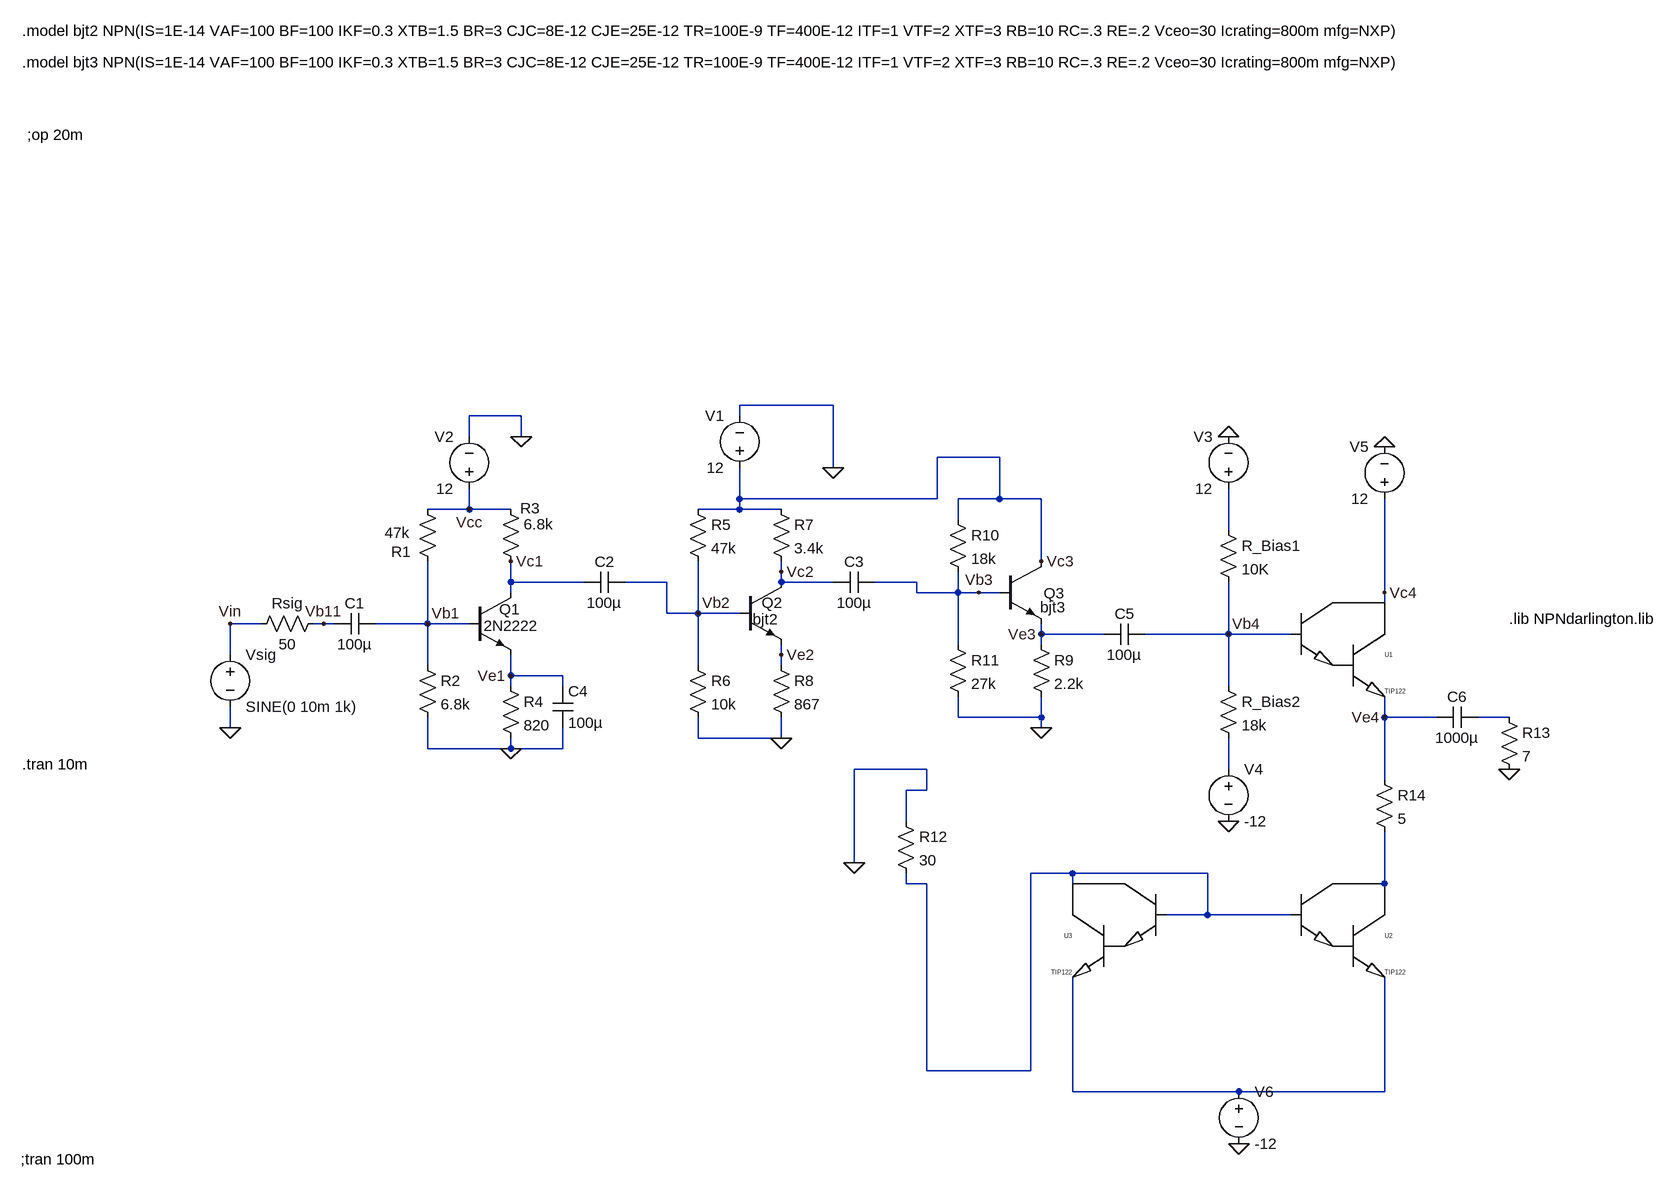
[diagram p0: schematic AMP.asc]
AMP.asc, the LTspice schematic file:
Version 4
SHEET 1 2644 1032
WIRE 736 -144 592 -144
WIRE 256 -128 176 -128
WIRE 592 -128 592 -144
WIRE 176 -96 176 -128
WIRE 256 -96 256 -128
WIRE 992 -64 896 -64
WIRE 736 -48 736 -144
WIRE 592 0 592 -48
WIRE 896 0 896 -64
WIRE 896 0 592 0
WIRE 992 0 992 -64
WIRE 992 0 928 0
WIRE 1056 0 992 0
WIRE 176 16 176 -16
WIRE 176 16 112 16
WIRE 240 16 176 16
WIRE 592 16 592 0
WIRE 592 16 528 16
WIRE 656 16 592 16
WIRE 928 32 928 0
WIRE 1344 48 1344 -16
WIRE 1056 96 1056 0
WIRE 656 112 656 96
WIRE 240 128 240 96
WIRE 352 128 240 128
WIRE 480 128 416 128
WIRE 656 128 656 112
WIRE 736 128 656 128
WIRE 864 128 800 128
WIRE 240 144 240 128
WIRE 864 144 864 128
WIRE 928 144 928 112
WIRE 928 144 864 144
WIRE 960 144 928 144
WIRE 992 144 960 144
WIRE 1584 144 1584 0
WIRE 1584 160 1584 144
WIRE 480 176 480 128
WIRE 528 176 528 96
WIRE 528 176 480 176
WIRE 592 176 528 176
WIRE -144 192 -192 192
WIRE -48 192 -64 192
WIRE -32 192 -48 192
WIRE 112 192 112 96
WIRE 112 192 32 192
WIRE 176 192 112 192
WIRE 1056 208 1056 192
WIRE 1152 208 1056 208
WIRE 1344 208 1344 128
WIRE 1344 208 1216 208
WIRE 1440 208 1344 208
WIRE 928 224 928 144
WIRE 1056 224 1056 208
WIRE -192 240 -192 192
WIRE 656 240 656 224
WIRE 112 256 112 192
WIRE 528 256 528 176
WIRE 656 256 656 240
WIRE 240 272 240 240
WIRE 320 272 240 272
WIRE 240 288 240 272
WIRE 320 288 320 272
WIRE 1344 288 1344 208
WIRE 928 336 928 304
WIRE 1056 336 1056 304
WIRE 1056 336 928 336
WIRE 1584 336 1584 304
WIRE 1664 336 1584 336
WIRE 1776 336 1728 336
WIRE -192 352 -192 320
WIRE 1056 352 1056 336
WIRE 528 368 528 336
WIRE 656 368 656 336
WIRE 656 368 528 368
WIRE 112 384 112 336
WIRE 240 384 240 368
WIRE 240 384 112 384
WIRE 320 384 320 352
WIRE 320 384 240 384
WIRE 880 416 768 416
WIRE 1344 416 1344 368
WIRE 1584 432 1584 336
WIRE 880 448 880 416
WIRE 880 448 848 448
WIRE 848 496 848 448
WIRE 768 560 768 416
WIRE 1104 576 1040 576
WIRE 1312 576 1104 576
WIRE 848 592 848 576
WIRE 880 592 848 592
WIRE 1104 592 1104 576
WIRE 1584 592 1584 512
WIRE 1584 624 1584 592
WIRE 1312 640 1312 576
WIRE 1312 640 1248 640
WIRE 1440 640 1312 640
WIRE 880 880 880 592
WIRE 1040 880 1040 576
WIRE 1040 880 880 880
WIRE 1104 912 1104 736
WIRE 1360 912 1104 912
WIRE 1584 912 1584 736
WIRE 1584 912 1360 912
FLAG 656 368 0
FLAG 256 -96 0
FLAG -192 352 0
FLAG 112 192 Vb1
FLAG 528 176 Vb2
FLAG 656 240 Ve2
FLAG 656 112 Vc2
FLAG 240 96 Vc1
FLAG -192 192 Vin
FLAG 176 16 Vcc
FLAG 240 272 Ve1
FLAG 736 -48 0
FLAG -48 192 Vb11
FLAG 240 384 0
FLAG 1056 352 0
FLAG 960 144 Vb3
FLAG 1056 208 Ve3
FLAG 1056 96 Vc3
FLAG 1344 -96 0
FLAG 1344 496 0
FLAG 1584 -80 0
FLAG 1776 416 0
FLAG 1344 208 Vb4
FLAG 1584 144 Vc4
FLAG 1584 336 Ve4
FLAG 1360 992 0
FLAG 768 560 0
SYMBOL npn 176 144 R0
WINDOW 0 46 26 Left 2
WINDOW 3 22 51 Left 2
SYMATTR InstName Q1
SYMATTR Value 2N2222
SYMBOL res 96 0 R0
WINDOW 0 -40 81 Left 2
WINDOW 3 -50 52 Left 2
SYMATTR InstName R1
SYMATTR Value 47k
SYMBOL res 96 240 R0
SYMATTR InstName R2
SYMATTR Value 6.8k
SYMBOL res 224 0 R0
WINDOW 0 30 14 Left 2
WINDOW 3 36 39 Left 2
SYMATTR InstName R3
SYMATTR Value 6.8k
SYMBOL res 224 272 R0
SYMATTR InstName R4
SYMATTR Value 820
SYMBOL res -48 176 R90
WINDOW 0 0 56 VBottom 2
WINDOW 3 32 56 VTop 2
SYMATTR InstName Rsig
SYMATTR Value 50
SYMBOL cap 32 176 R90
WINDOW 0 0 32 VBottom 2
WINDOW 3 32 32 VTop 2
SYMATTR InstName C1
SYMATTR Value 100µ
SYMBOL npn 592 128 R0
WINDOW 0 34 32 Left 2
WINDOW 3 20 57 Left 2
SYMATTR InstName Q2
SYMATTR Value bjt2
SYMBOL res 640 0 R0
SYMATTR InstName R7
SYMATTR Value 3.4k
SYMBOL res 512 0 R0
SYMATTR InstName R5
SYMATTR Value 47k
SYMBOL res 512 240 R0
SYMATTR InstName R6
SYMATTR Value 10k
SYMBOL res 640 240 R0
SYMATTR InstName R8
SYMATTR Value 867
SYMBOL cap 800 112 R90
WINDOW 0 0 32 VBottom 2
WINDOW 3 32 32 VTop 2
SYMATTR InstName C3
SYMATTR Value 100µ
SYMBOL voltage -192 224 R0
WINDOW 123 0 0 Left 0
WINDOW 39 0 0 Left 0
SYMATTR InstName Vsig
SYMATTR Value SINE(0 10m 1k)
SYMBOL voltage 176 0 R180
WINDOW 0 24 96 Left 2
WINDOW 3 24 16 Left 2
WINDOW 123 0 0 Left 0
WINDOW 39 0 0 Left 0
SYMATTR InstName V2
SYMATTR Value 12
SYMBOL voltage 592 -32 R180
WINDOW 0 24 96 Left 2
WINDOW 3 24 16 Left 2
SYMATTR InstName V1
SYMATTR Value 12
SYMBOL cap 416 112 R90
WINDOW 0 0 32 VBottom 2
WINDOW 3 32 32 VTop 2
SYMATTR InstName C2
SYMATTR Value 100µ
SYMBOL cap 304 288 R0
SYMATTR InstName C4
SYMATTR Value 100µ
SYMBOL npn 992 96 R0
WINDOW 0 68 49 Left 2
WINDOW 3 62 71 Left 2
SYMATTR InstName Q3
SYMATTR Value bjt3
SYMBOL res 1040 208 R0
SYMATTR InstName R9
SYMATTR Value 2.2k
SYMBOL res 912 16 R0
SYMATTR InstName R10
SYMATTR Value 18k
SYMBOL res 912 208 R0
SYMATTR InstName R11
SYMATTR Value 27k
SYMBOL cap 1216 192 R90
WINDOW 0 0 32 VBottom 2
WINDOW 3 32 32 VTop 2
SYMATTR InstName C5
SYMATTR Value 100µ
SYMBOL NpnDarlington 1456 160 R0
WINDOW 3 128 136 Left 0
SYMATTR InstName U1
SYMATTR SpiceModel ""
SYMBOL res 1328 32 R0
SYMATTR InstName R_Bias1
SYMATTR Value 10K
SYMBOL res 1328 272 R0
SYMATTR InstName R_Bias2
SYMATTR Value 18k
SYMBOL voltage 1344 0 R180
WINDOW 0 24 96 Left 2
WINDOW 3 24 16 Left 2
SYMATTR InstName V3
SYMATTR Value 12
SYMBOL voltage 1344 400 R0
SYMATTR InstName V4
SYMATTR Value -12
SYMBOL voltage 1584 16 R180
WINDOW 0 24 96 Left 2
WINDOW 3 24 16 Left 2
SYMATTR InstName V5
SYMATTR Value 12
SYMBOL cap 1728 320 R90
WINDOW 0 0 32 VBottom 2
WINDOW 3 32 32 VTop 2
SYMATTR InstName C6
SYMATTR Value 1000µ
SYMBOL res 1760 320 R0
SYMATTR InstName R13
SYMATTR Value 7
SYMBOL NpnDarlington 1456 592 R0
WINDOW 3 128 136 Left 0
SYMATTR InstName U2
SYMATTR SpiceModel ""
SYMBOL NpnDarlington 1232 592 M0
WINDOW 3 128 136 Left 0
SYMATTR InstName U3
SYMATTR SpiceModel ""
SYMBOL voltage 1360 896 R0
SYMATTR InstName V6
SYMATTR Value -12
SYMBOL res 832 480 R0
SYMATTR InstName R12
SYMATTR Value 30
SYMBOL res 1568 416 R0
SYMATTR InstName R14
SYMATTR Value 5
TEXT -504 -560 Left 2 !;op 20m
TEXT -512 -720 Left 2 !.model bjt2 NPN(IS=1E-14 VAF=100 BF=100 IKF=0.3 XTB=1.5 BR=3 CJC=8E-12 CJE=25E-12 TR=100E-9 TF=400E-12 ITF=1 VTF=2 XTF=3 RB=10 RC=.3 RE=.2 Vceo=30 Icrating=800m mfg=NXP)
TEXT -512 -672 Left 2 !.model bjt3 NPN(IS=1E-14 VAF=100 BF=100 IKF=0.3 XTB=1.5 BR=3 CJC=8E-12 CJE=25E-12 TR=100E-9 TF=400E-12 ITF=1 VTF=2 XTF=3 RB=10 RC=.3 RE=.2 Vceo=30 Icrating=800m mfg=NXP)
TEXT -512 408 Left 2 !.tran 10m
TEXT 1776 184 Left 2 !.lib NPNdarlington.lib
TEXT -514 1016 Left 2 !;tran 100m

The netlist it stands for:
* AMP.asc
Q1 Vc1 Vb1 Ve1 0 2N2222
R1 Vcc Vb1 47k
R2 Vb1 0 6.8k
R3 Vcc Vc1 6.8k
R4 Ve1 0 820
Rsig Vb11 Vin 50
C1 Vb1 Vb11 100µ
Q2 Vc2 Vb2 Ve2 0 bjt2
R7 Vc3 Vc2 3.4k
R5 Vc3 Vb2 47k
R6 Vb2 0 10k
R8 Ve2 0 867
C3 Vb3 Vc2 100µ
Vsig Vin 0 SINE(0 10m 1k)
V2 Vcc 0 12
V1 Vc3 0 12
C2 Vb2 Vc1 100µ
C4 Ve1 0 100µ
Q3 Vc3 Vb3 Ve3 0 bjt3
R9 Ve3 0 2.2k
R10 Vc3 Vb3 18k
R11 Vb3 0 27k
C5 Vb4 Ve3 100µ
XU1 Vc4 Vb4 Ve4 TIP122  ; pins C B E
R_Bias1 N001 Vb4 10K
R_Bias2 Vb4 N003 18k
V3 N001 0 12
V4 N003 0 -12
V5 Vc4 0 12
C6 N002 Ve4 1000µ
R13 N002 0 7
XU2 N005 N004 N006 TIP122  ; pins C B E
XU3 N004 N004 N006 TIP122  ; pins C B E
V6 N006 0 -12
R12 0 N004 30
R14 Ve4 N005 5
.model NPN NPN
.model PNP PNP
.lib standard.bjt
;op 20m
.model bjt2 NPN(IS=1E-14 VAF=100 BF=100 IKF=0.3 XTB=1.5 BR=3 CJC=8E-12 CJE=25E-12 TR=100E-9 TF=400E-12 ITF=1 VTF=2 XTF=3 RB=10 RC=.3 RE=.2 Vceo=30 Icrating=800m mfg=NXP)
.model bjt3 NPN(IS=1E-14 VAF=100 BF=100 IKF=0.3 XTB=1.5 BR=3 CJC=8E-12 CJE=25E-12 TR=100E-9 TF=400E-12 ITF=1 VTF=2 XTF=3 RB=10 RC=.3 RE=.2 Vceo=30 Icrating=800m mfg=NXP)
.tran 10m
.lib NPNdarlington.lib
;tran 100m
.backanno
.end